# EAGLE design m5stack-rfm95 (EAGLE 9.2.0)
PROJECT_AUTHOR: XOSE PEREZ <xose.perez@gmail.com>; PROJECT_LICENSE: CC-SA-BY-4.0; PROJECT_NAME: M5STACK RMF95; PROJECT_VERSION: 0.2.20181030
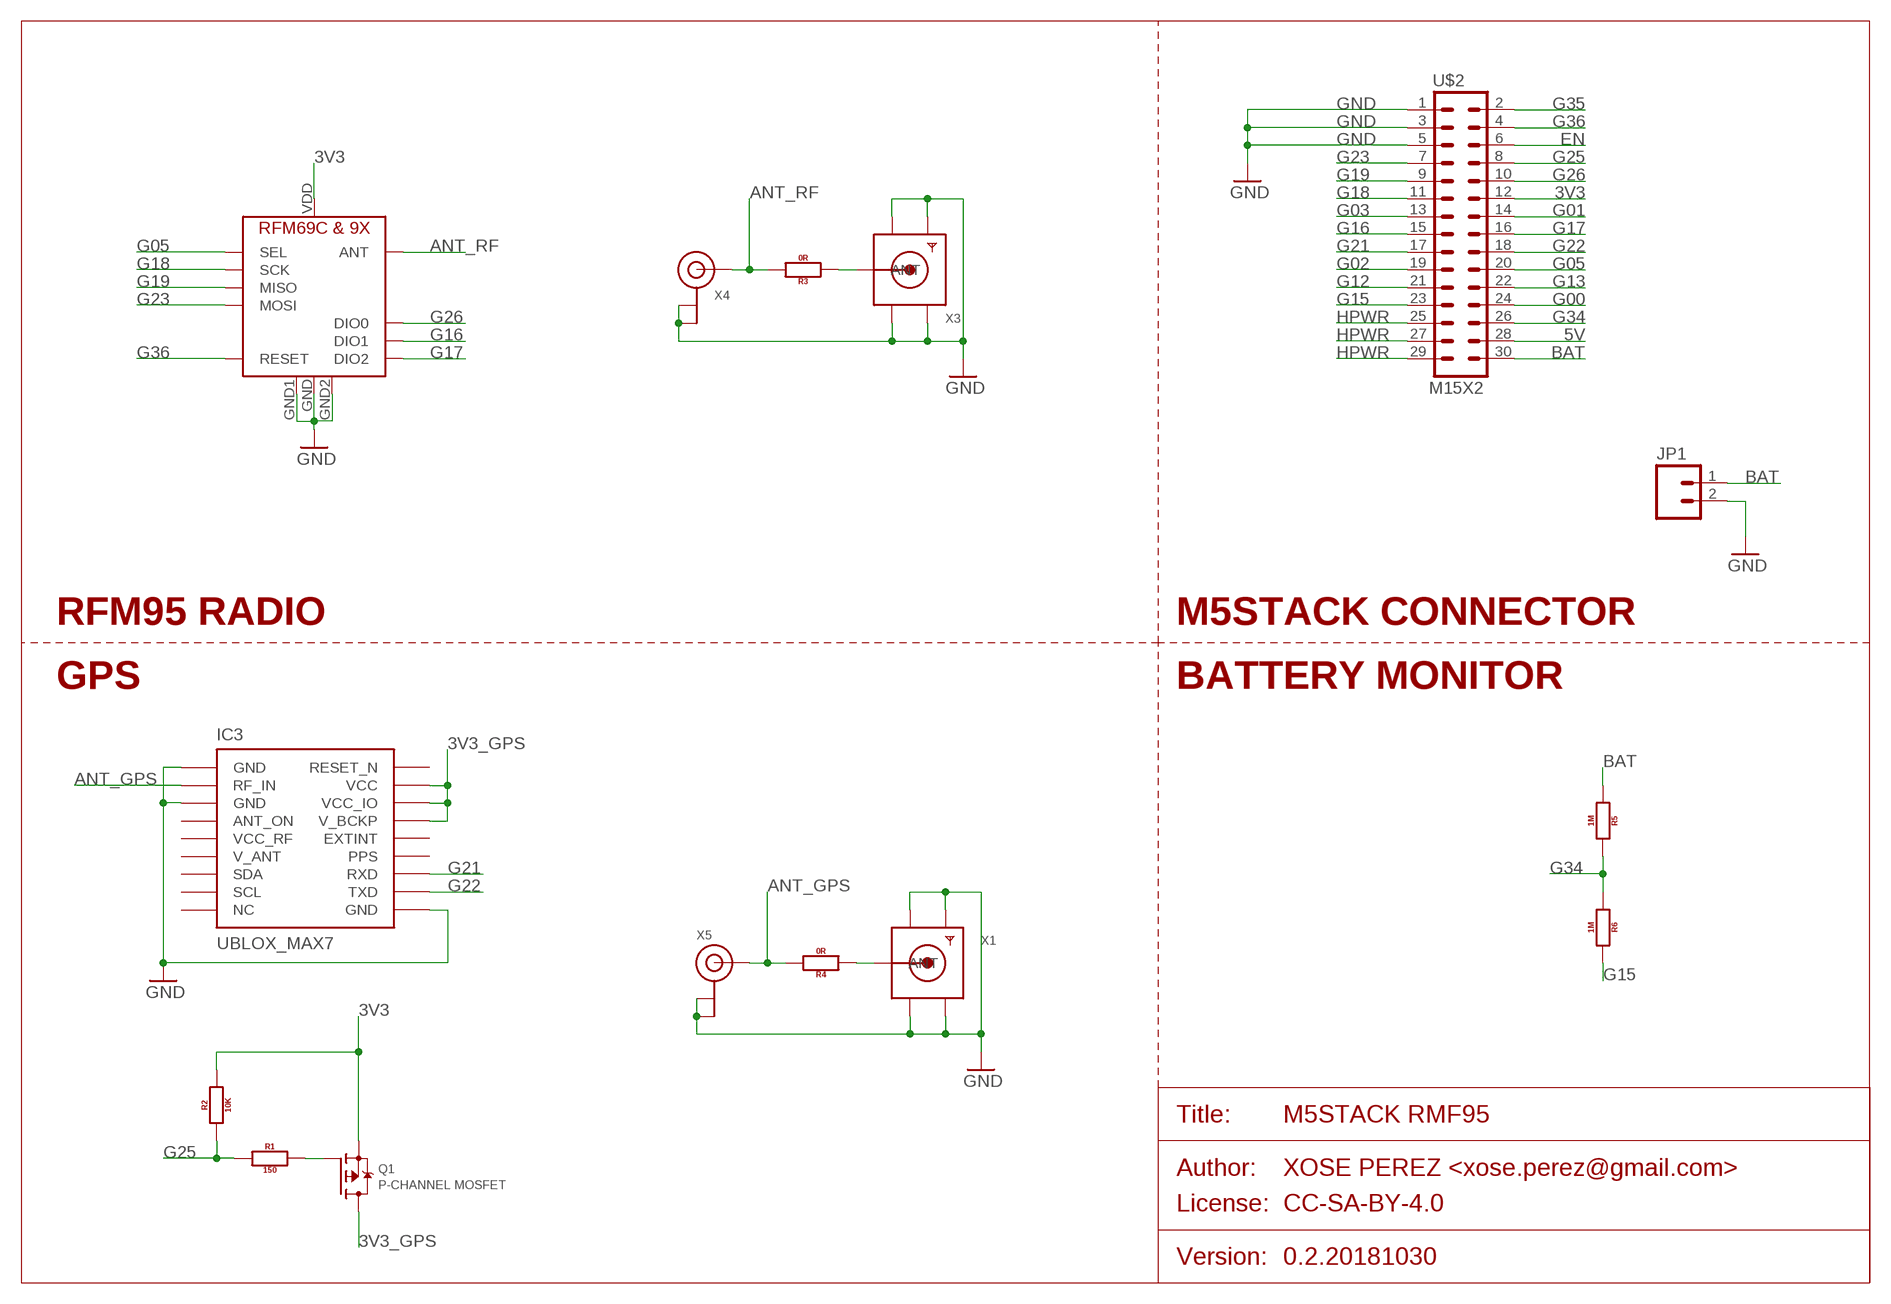
[diagram p0: schematic, sheet 1]

## Parts
IC1  RFM69HCW-RFM95  [RFM69HCW-RFM95-MINPADS]
IC3  UBLOX_MAX7  [UBLOX_MAX7]
JP1  M02-JST-2MM-SMT  [JST-2-SMD]
Q1  P-CHANNEL MOSFET  MOSFET-P  [SOT23-R]
R1  150  RESISTOR0805  [0805]
R2  10K  RESISTOR0805  [0805]
R3  0R  RESISTOR0805  [0805]
R4  0R  RESISTOR0805  [0805]
R5  1M  RESISTOR0805  [0805]
R6  1M  RESISTOR0805  [0805]
U$2  M15X2  [2X15]
X1  SMACONNECTOR  [SMA90_DIP]
X3  SMACONNECTOR  [SMA90_DIP]
X4  ANTENNA_U.FL  [U.FL]
X5  ANTENNA_U.FL  [U.FL]

## Nets
3V3: IC1.VDD(VCC) Q1.2(S) R2.2 U$2.12
3V3_GPS: IC3.P$6(V_BCKP) IC3.P$7(VCC_IO) IC3.P$8(VCC) Q1.3(D)
5V: U$2.28
ANT_GPS: IC3.P$11(RF_IN) R4.2 X5.3(SIGNAL)
ANT_RF: IC1.ANT R3.2 X4.3(SIGNAL)
BAT: JP1.1 R5.1 U$2.30
EN: U$2.6
G00: U$2.24
G01: U$2.14
G02: U$2.19
G03: U$2.13
G05: IC1.NSS(SEL) U$2.20
G12: U$2.21
G13: U$2.22
G15: R6.2 U$2.23
G16: IC1.DIO1 U$2.15
G17: IC1.DIO2 U$2.16
G18: IC1.SCK U$2.11
G19: IC1.MISO U$2.9
G21: IC3.P$3(RXD) U$2.17
G22: IC3.P$2(TXD) U$2.18
G23: IC1.MOSI U$2.7
G25: R1.1 R2.1 U$2.8
G26: IC1.DIO0 U$2.10
G34: R5.2 R6.1 U$2.26
G35: U$2.2
G36: IC1.RESET U$2.4
GND [power]: IC1.GND IC1.GND1 IC1.GND2 IC3.P$1(GND) IC3.P$10(GND) IC3.P$12(GND) JP1.2 U$2.1 U$2.3 U$2.5 X1.GND1 X1.GND2 X1.GND3 X1.GND4 X3.GND1 X3.GND2 X3.GND3 X3.GND4 X4.1(GND) X4.2(GND) X5.1(GND) X5.2(GND)
HPWR: U$2.25 U$2.27 U$2.29
N$1: R4.1 X1.ANTENNA(ANT)
N$2: R3.1 X3.ANTENNA(ANT)
N$3: Q1.1(G) R1.2
Unconnected: IC3.P$4(PPS) IC3.P$5(EXTINT) IC3.P$9(RESET_N) IC3.P$13(ANT_ON) IC3.P$16(SDA) IC3.P$17(SCL) IC3.P$18(NC)

## Notes on the sheet
- RFM95 RADIO | M5STACK CONNECTOR
- GPS | BATTERY MONITOR

## Power pins joined to a net without a drawn wire
V_ANT: IC3.P$15(V_ANT)
VCC_RF: IC3.P$14(VCC_RF)

## Library data of the parts
IC1 = xose:RFM69HCW-RFM95
IC3 = xose:UBLOX_MAX7
JP1 = xose:M02: Standard 2-pin 0.1" header. Use with - straight break away headers ( PRT-00116) - right angle break away headers (PRT-00553) - swiss pins (PRT-00743) - machine pins (PRT-00117) - female headers (PRT-00115) Molex polarized connector foot print use with: PRT-08233 with associated crimp pins and housings. 2.54_SCREWTERM for use with PRT-10571. 3.5mm Screw Terminal footprints for PRT-08084 5mm Screw Terminal footprints for use with PRT-08432; PROD_ID: CONN-11443
Q1 = xose:MOSFET-P: P-Channel Mosfet LEGEND VDS: Voltage Drain-Source ID: Drain Current RDS(ON): Drain-Source On-State Resistance VGS(TH): Gate-Source Threshold Voltage CISS: Drain-Source Input Capacitance SOT-23 Name VDS ID RDS(ON) VGS(TH) CISS Order Number IRLML5103 30V 760mA 600 mOhm -- 75pF @ 25V Digikey: IRLML5103PBFCT-ND IRLML6401 12V 4.3A 50 mOhm 950mV @ 250µA 830pF @ 10V Digikey: IRLML6401PBFTR-ND NTR0202PL 20V 400mA 800 mOhm 2.3V @ 250uA 70pF @ 5V Digikey: NTR0202PLT1GOSTR-ND NTR4101PT1G 20V 1.8A 85 mOhm 1.2V @ 250uA 675pF @ 10V Digikey: NTR4101PT1GOSCT-ND DMP2004K 20V 600mA 900 mOhm 1V @ 250uA 175pF @ 16V Digikey: DMP2004KDICT-ND PMV65XP 20V 3.9A 76 mOhm 950mV @ 1mA 725pF @ 20V Digikey: 568-2358-2-ND TO-252 Name VDS ID RDS(ON) VGS(TH) CISS Order Number AOD417 30V 25A 34 mOhm 3V @ 250µA 920pF @ 15V Digikey: 785-1106-2-ND
R1-R6 = xose:RESISTOR: Generic EU resistor symbol
U$2 = xose:M15X2
X1 X3 = adafruit:SMACONNECTOR: SMA Connector 90° DIP SMA Connector, 50 Ohm (4UConnector: 07259)
X4 X5 = adafruit:ANTENNA_U.FL: U.FL Antenna Connector

## Net classes
1 power: width 0.381 mm, clearance 0.254 mm

## Board
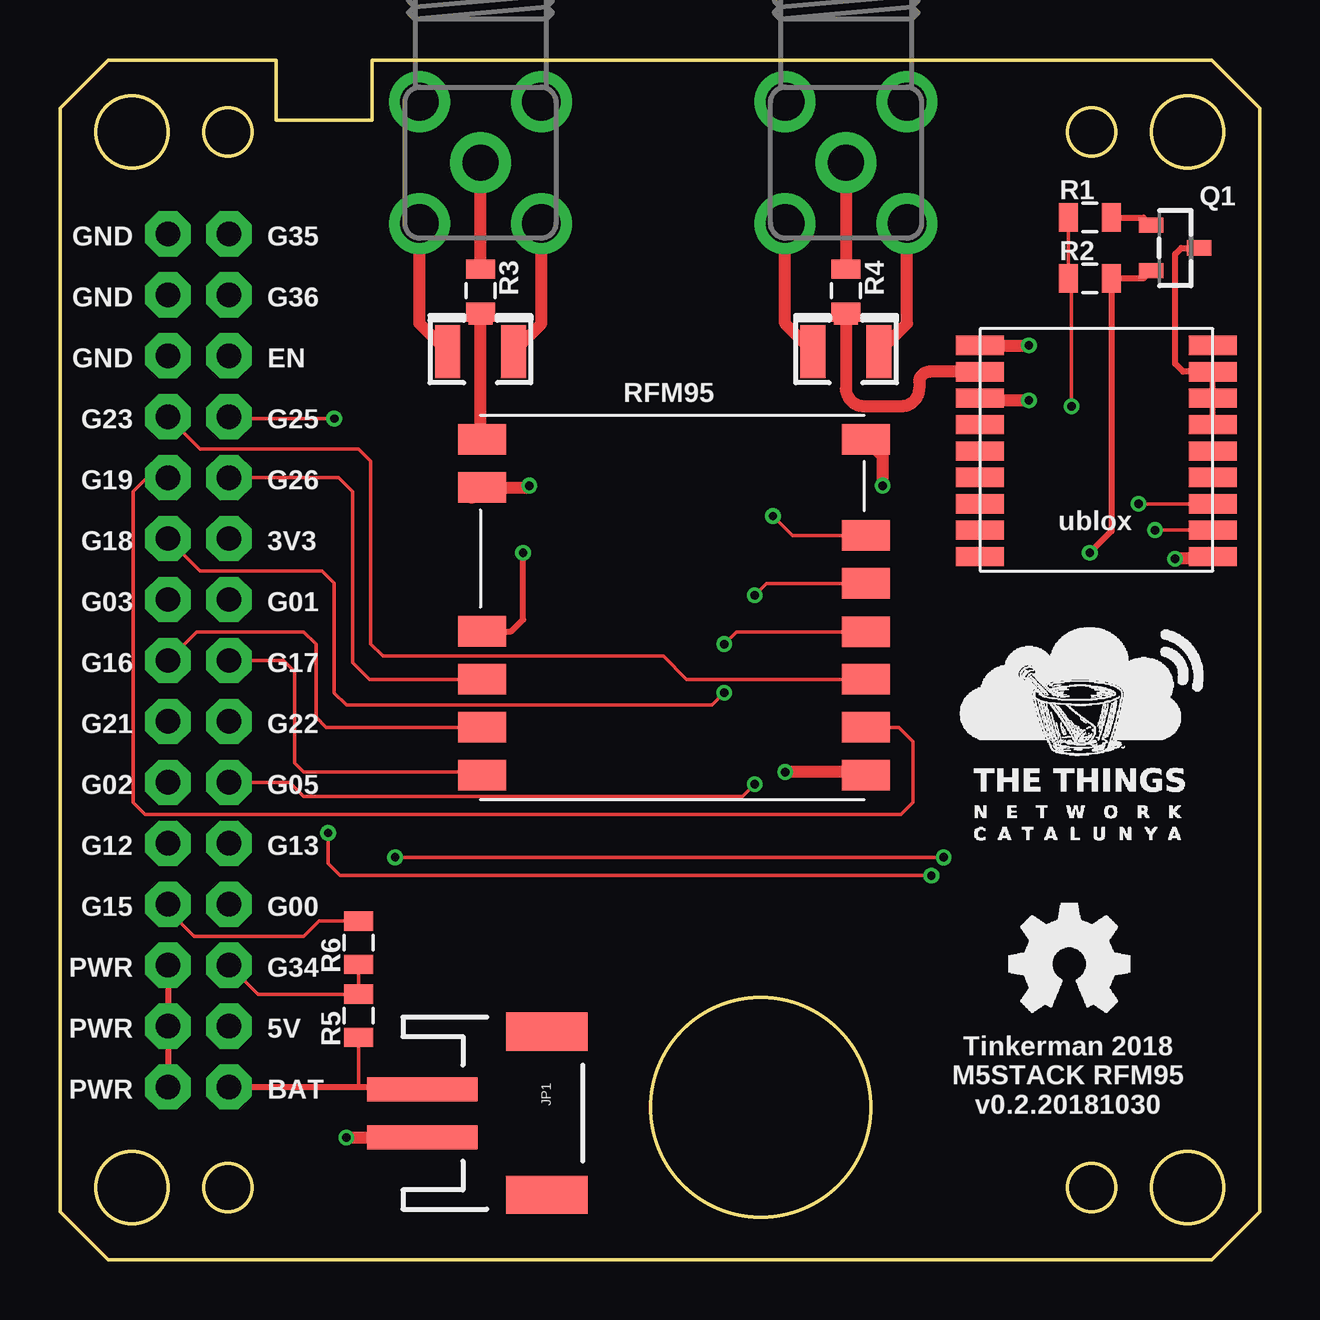
[diagram p1: board, top side]
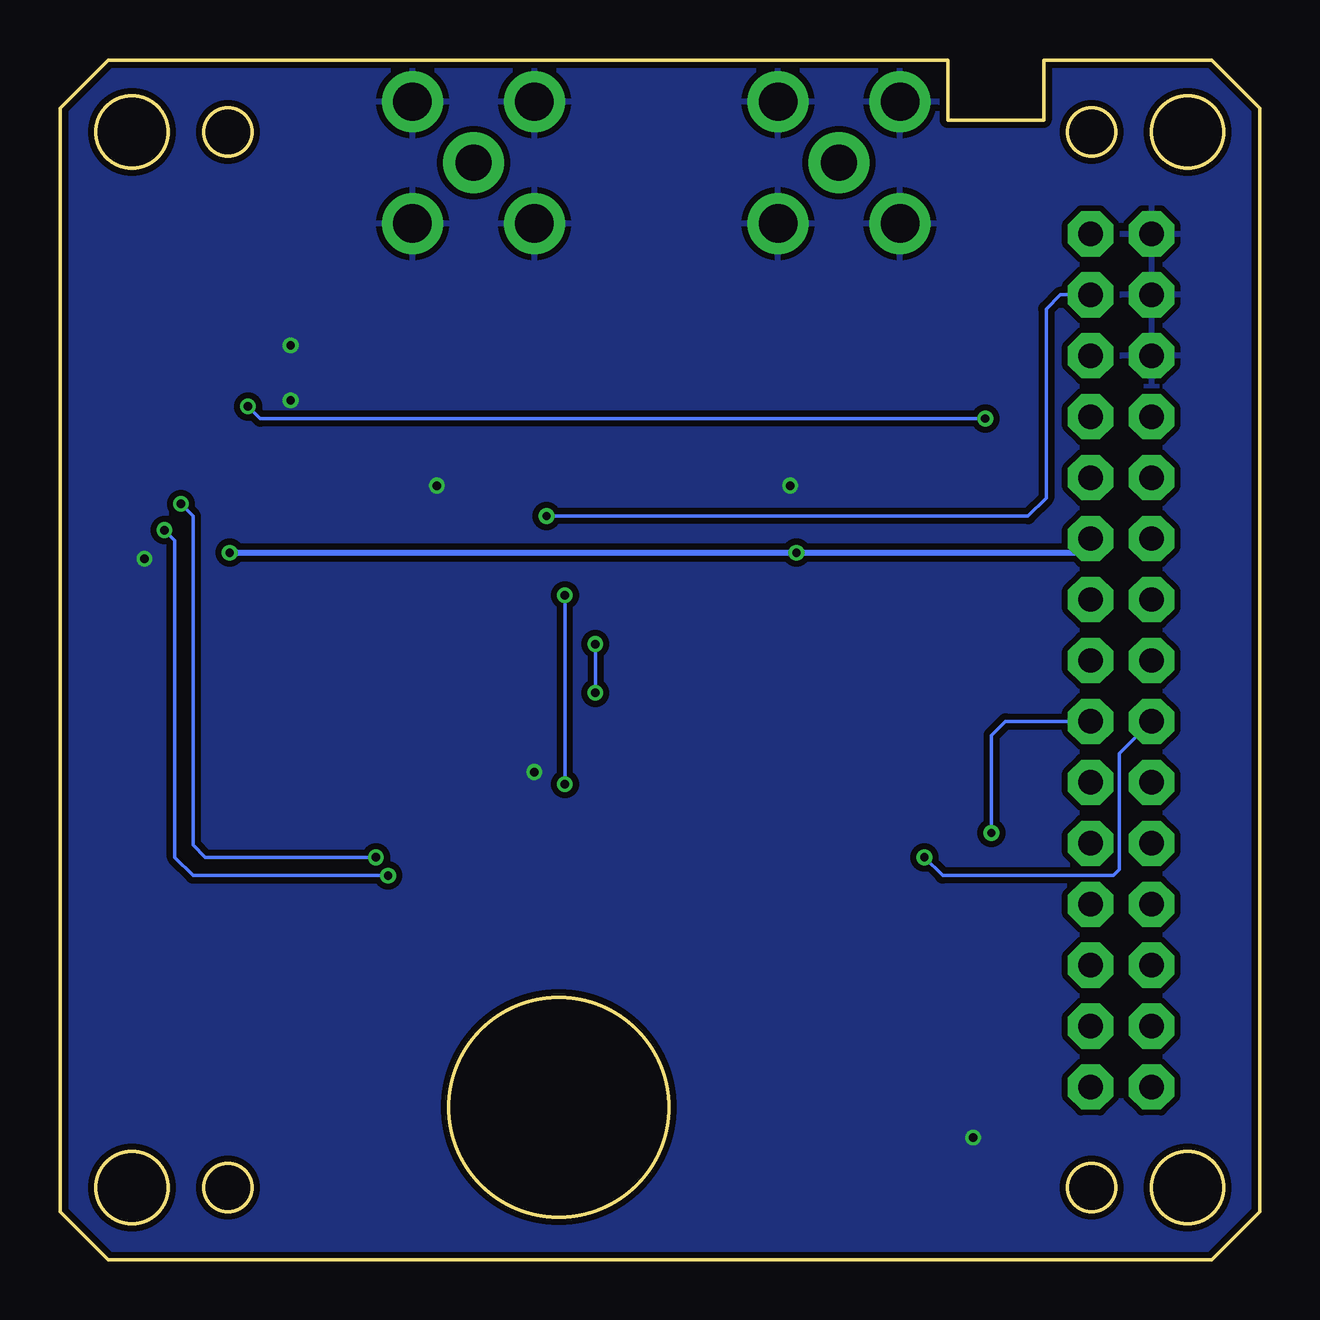
[diagram p2: board, bottom side, seen from below]

Size 50 x 50 mm. Coordinates in mm from the lower left corner, seen from the top.
Outline: 2,0 0,2 0,48 2,50 9,50 9,47.5 13,47.5 13,50 48,50 50,48 50,2 48,0 2,0
Outline: circle at 3,47 radius 1.5
Outline: circle at 7,47 radius 1
Outline: circle at 3,3 radius 1.5
Outline: circle at 47,3 radius 1.5
Outline: circle at 47,47 radius 1.5
Outline: circle at 43,47 radius 1
Outline: circle at 43,3 radius 1
Outline: circle at 7,3 radius 1
Outline: circle at 29.21,6.35 radius 4.57
Copper layers (1*16): Top 0.035mm / dielectric 1.5mm / Bottom 0.035mm
Design rules "seedstudio-2layer": minimum track width 6mil, minimum drill 12mil, track to track 6mil, track to pad 6mil, pad to pad 6mil, via to via 6mil, smd to smd 0mil, copper to edge 10mil, drill to drill 10mil, minimum pad ring 10mil, minimum via ring 6mil, stop-mask expansion 2mil, vias tented up to drill 100mil, thermal gap 10mil

### Footprints (pad centres in the part's own frame; a part is rotated, then mirrored left to right if it is on the bottom)
RFM69HCW-RFM95-MINPADS = smd 2 x 1.27: ANT 5.777,-7; DIO0 5.777,3; DIO1 5.779,5; DIO2 5.779,7; GND 5.777,-5; GND1 -10.223,7; GND2 -10.23,-7; MISO -10.23,5; MOSI -10.225,3; NSS -10.223,-1; RESET -10.223,-3; SCK -10.23,1.012; VDD 5.777,1
UBLOX_MAX7 = smd 2 x 0.8: P$1 9.7,0.6; P$2 9.7,1.7; P$3 9.7,2.8; P$4 9.7,3.9; P$5 9.7,5; P$6 9.7,6.1; P$7 9.7,7.2; P$8 9.7,8.3; P$9 9.7,9.4; P$10 0,9.4; P$11 0,8.3; P$12 0,7.2; P$13 0,6.1; P$14 0,5; P$15 0,3.9; P$16 0,2.8; P$17 0,1.7; P$18 0,0.6
JST-2-SMD = smd 1 x 4.6: 1 -1,-3.7; 2 1,-3.7 | smd 1.6 x 3.4: NC1 -3.4,1.5; NC2 3.4,1.5
SOT23-R = smd 0.635 x 1.016: 1 -0.95,-1; 2 0.95,-1; 3 0,1
0805 = smd 0.8 x 1.2: 1 -0.9,0; 2 0.9,0
2X15 = drill 1.016 pad 1.88 octagon: 1 0,0; 2 0,2.54; 3 2.54,0; 4 2.54,2.54; 5 5.08,0; 6 5.08,2.54; 7 7.62,0; 8 7.62,2.54; 9 10.16,0; 10 10.16,2.54; 11 12.7,0; 12 12.7,2.54; 13 15.24,0; 14 15.24,2.54; 15 17.78,0; 16 17.78,2.54; 17 20.32,0; 18 20.32,2.54; 19 22.86,0; 20 22.86,2.54; 21 25.4,0; 22 25.4,2.54; 23 27.94,0; 24 27.94,2.54; 25 30.48,0; 26 30.48,2.54; 27 33.02,0; 28 33.02,2.54; 29 35.56,0; 30 35.56,2.54
SMA90_DIP = drill 1.5 pad 2.54: ANTENNA 0,0 | drill 1.6 pad 2.54: GND1 -2.54,2.54; GND2 2.54,2.54; GND3 -2.54,-2.54; GND4 2.54,-2.54
U.FL = smd 2.2 x 1.05: 1 0,1.375; 2 0,-1.375 | smd 0.8 x 1: 3 1.525,0

### Placement (x,y rotation side)
IC1  23.37,27.18 180 top
IC3  38.35,28.7 0 top
JP1  18.8,6.1 270 top
Q1  46.48,42.16 270 top
R1  42.93,43.43 0 top
R2  42.93,40.89 0 top
R3  17.53,40.39 270 top
R4  32.77,40.39 270 top
R5  12.45,10.16 90 top
R6  12.45,13.21 90 top
U$2  4.5,42.75 270 top
X1  32.77,45.72 0 top
X3  17.53,45.72 0 top
X4  17.53,37.85 90 top
X5  32.77,37.85 90 top

### Tracks (layer width: path | path; a pad name or v marks a point on that pad's centre or on a via)
3V3  (via drill 0.35)
  Top 0.254: Q1.2 45.16,40.89 R2.2 43.83,30.36 v42.93,29.46 | IC1.VDD 18.81,26.18 19.3,26.67 v19.3,29.46
  Bottom 0.254: U$2.12 7.63,29.46 v19.3,29.46 v42.93,29.46
3V3_GPS
  Top 0.254: IC3.P$6 IC3.P$7 IC3.P$8 46.82,37 46.48,37.34 46.48,41.91 46.74,42.16 Q1.3
ANT_GPS
  Top 0.508: IC3.P$11 36.24,37 arc90 35.81,36.58 35.81,36.32 arc-90 35.05,35.56 33.53,35.56 arc-90 32.77,36.32 X5.3 R4.2
ANT_RF
  Top 0.508: X4.3 R3.2 17.53,34.24 arc90 IC1.ANT
BAT
  Top 0.152: R5.1 12.45,7.19
  Top 0.254: U$2.30 12.45,7.19 15.1,7.19 JP1.1
G05  (via drill 0.35)
  Top 0.152: U$2.20 9.57,19.89 10.16,19.3 28.45,19.3 v28.96,19.81 | v28.96,27.69 29.45,28.18 IC1.NSS
  Bottom 0.152: v28.96,19.81 v28.96,27.69
G15
  Top 0.152: U$2.23 4.5,14.55 5.59,13.46 10.16,13.46 10.81,14.11 R6.2
G16
  Top 0.152: U$2.15 5.69,26.16 10.16,26.16 10.67,25.65 10.67,22.61 11.1,22.18 IC1.DIO1
G17
  Top 0.152: U$2.16 9.32,24.97 9.78,24.51 9.78,20.7 10.16,20.32 17.45,20.32
  Top 0.254: IC1.DIO2 17.45,20.32
G18  (via drill 0.35)
  Top 0.152: U$2.11 5.85,28.7 10.92,28.7 11.43,28.19 11.43,23.62 11.94,23.11 27.18,23.11 v27.69,23.62 | IC1.SCK 28.19,26.16 v27.69,25.65
  Bottom 0.152: v27.69,25.65 v27.69,23.62
G19
  Top 0.152: U$2.9 3.63,32.59 3.05,32 3.05,19.05 3.56,18.54 35.05,18.54 35.56,19.05 35.56,21.59 34.97,22.18 IC1.MISO
G21  (via drill 0.35)
  Top 0.152: v36.83,16.76 v13.97,16.76 | v44.96,31.5 IC3.P$3
  Bottom 0.152: U$2.17 5.84,21.09 5.84,16.26 6.1,16 13.21,16 v13.97,16.76 | v36.83,16.76 43.94,16.76 44.45,17.27 44.45,30.99 v44.96,31.5
G22  (via drill 0.35)
  Top 0.152: v11.18,17.78 11.18,16.51 11.68,16 v36.32,16 | v45.64,30.4 IC3.P$2
  Bottom 0.152: U$2.18 10.59,22.43 11.18,21.84 v11.18,17.78 | v36.32,16 44.45,16 45.21,16.76 45.21,29.97 v45.64,30.4
G23
  Top 0.152: U$2.7 5.85,33.78 12.45,33.78 12.95,33.27 12.95,25.65 13.46,25.15 25.15,25.15 26.11,24.18 IC1.MOSI
G25  (via drill 0.35)
  Top 0.152: R1.1 R2.1 42.16,40.76 v42.16,35.56 | U$2.8 7.12,35.05 v11.43,35.05
  Bottom 0.152: v11.43,35.05 41.66,35.05 v42.16,35.56
G26
  Top 0.152: U$2.10 11.61,32.59 12.19,32 12.19,24.89 12.91,24.18 IC1.DIO0
G34
  Top 0.152: R6.1 R5.2 8.25,11.06 U$2.26
G36  (via drill 0.35)
  Top 0.152: v29.72,30.99 30.53,30.18 IC1.RESET
  Bottom 0.152: U$2.4 8.3,40.21 8.89,39.62 8.89,31.75 9.65,30.99 v29.72,30.99
GND  (via drill 0.35)
  Top 0.381: JP1.2 15.1,5.08
  Top 0.508: IC1.GND 17.28,32.18 | IC1.GND1 33.45,20.32 v30.23,20.32 | 15.1,5.08 v11.94,5.08 | IC1.GND 17.16,31.75 | X4.2 20.07,39.01 X3.GND4 | X5.1 30.23,39.01 X1.GND3 | X5.2 35.31,39.01 X1.GND4 | X4.1 14.99,39.01 X3.GND3 | IC3.P$12 38.44,35.81 v40.39,35.81 | IC3.P$1 47.96,29.21 v46.48,29.21 | IC3.P$10 v40.38,38.1 v40.39,38.1 | IC1.GND 19.48,32.18 v19.56,32.26 | IC1.GND2 34.29,33.49 v34.29,32.26
  pour Bottom: 0,0 0,50.04 50.04,50.04 50.04,0
HPWR
  Top 0.254: U$2.25 U$2.27 U$2.29
N$1
  Top 0.508: X1.ANTENNA R4.1
N$2
  Top 0.508: R3.1 X3.ANTENNA
N$3
  Top 0.254: R1.2 45.16,43.43 Q1.1

### Text on the board
tNames: GND | G35 | GND | G36 | GND | EN | RFM95 | G23 | G25 | G19 | G26 | G18 | 3V3 | G03 | G01 | G16 | G17 | G21 | G22 | G02 | G05 | G12 | G13 | G15 | G00 | PWR | G34 | PWR | 5V | Tinkerman 2018 / M5STACK RFM95 / v0.2.20181030 | PWR | BAT